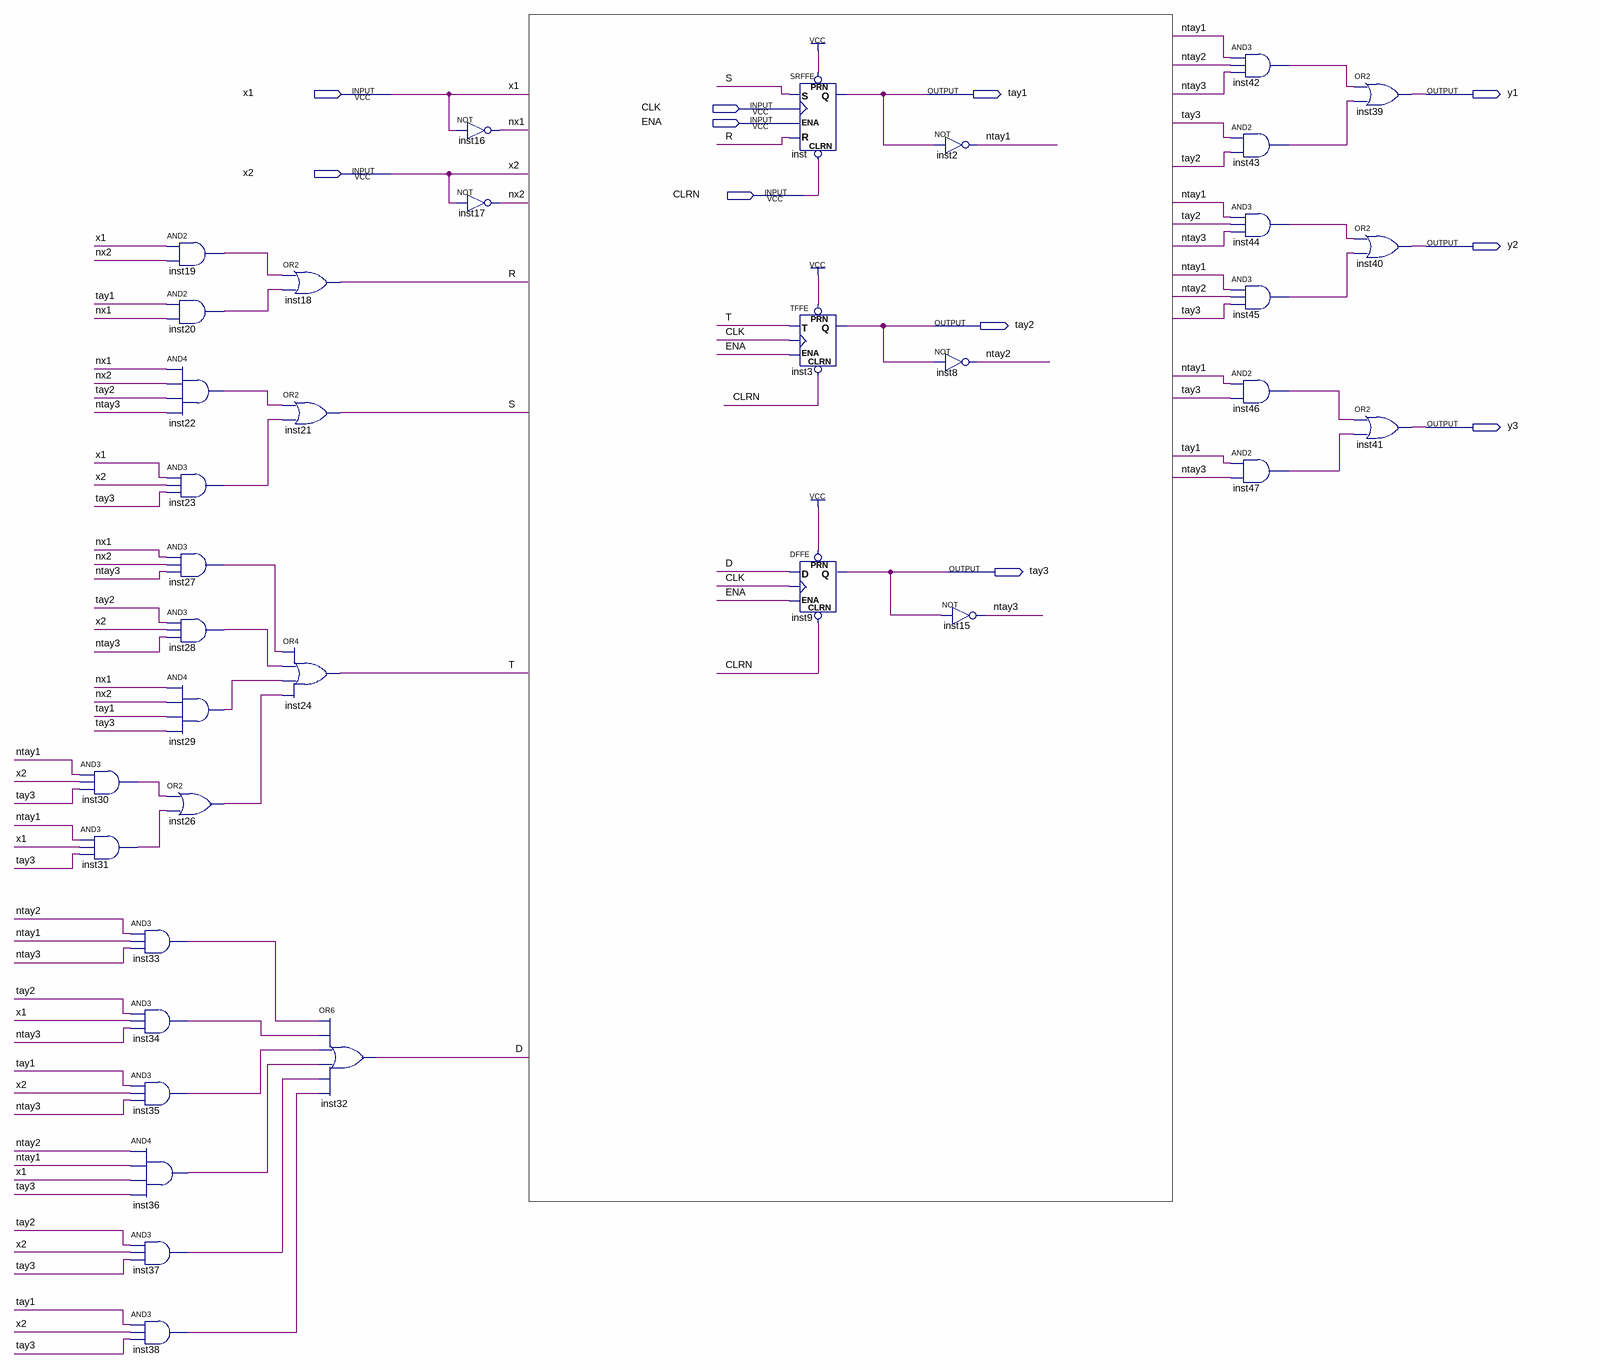
[diagram p0: schematic sheet]
// Quartus schematic a_moore.bdf as structural Verilog: 37 symbols, 11 pins
module a_moore (
  input  x1,
  input  CLK,
  input  ENA,
  input  x2,
  input  CLRN,
  output tay1,
  output y1,
  output y2,
  output tay2,
  output y3,
  output tay3
);

  wire D, inst19_out, inst20_out, inst22_out, inst23_out, inst26_out, inst27_out, inst28_out, inst29_out,
       inst30_out, inst31_out, inst33_out, inst34_out, inst35_out, inst36_out, inst37_out, inst38_out,
       inst42_out, inst43_out, inst44_out, inst45_out, inst46_out, inst47_out, ntay1, ntay2, ntay3, nx1, nx2,
       R, S, T;

  and inst30 (inst30_out, ntay1, x2, tay3);
  and inst31 (inst31_out, ntay1, x1, tay3);
  and inst33 (inst33_out, ntay2, ntay1, ntay3);
  and inst34 (inst34_out, tay2, x1, ntay3);
  and inst35 (inst35_out, tay1, x2, ntay3);
  and inst36 (inst36_out, ntay2, ntay1, x1, tay3);
  and inst37 (inst37_out, tay2, x2, tay3);
  and inst38 (inst38_out, tay1, x2, tay3);
  and inst19 (inst19_out, x1, nx2);
  and inst20 (inst20_out, tay1, nx1);
  and inst22 (inst22_out, nx1, nx2, tay2, ntay3);
  and inst23 (inst23_out, x1, x2, tay3);
  and inst27 (inst27_out, nx1, nx2, ntay3);
  and inst28 (inst28_out, tay2, x2, ntay3);
  and inst29 (inst29_out, nx1, nx2, tay1, tay3);
  or inst26 (inst26_out, inst30_out, inst31_out);
  or inst18 (R, inst19_out, inst20_out);
  or inst21 (S, inst22_out, inst23_out);
  or inst24 (T, inst27_out, inst28_out, inst29_out, inst26_out);
  or inst32 (D, inst33_out, inst34_out, inst35_out, inst36_out, inst37_out, inst38_out);
  not inst16 (nx1, x1);
  not inst17 (nx2, x2);
  SRFFE inst (.PRN(1'b1), .S(S), .CLK(CLK), .CLRN(CLRN), .R(R), .ENA(ENA), .Q(tay1));
  TFFE inst3 (.CLRN(CLRN), .T(T), .CLK(CLK), .ENA(ENA), .PRN(1'b1), .Q(tay2));
  DFFE inst9 (.PRN(1'b1), .CLRN(CLRN), .D(D), .CLK(CLK), .ENA(ENA), .Q(tay3));
  not inst2 (ntay1, tay1);
  not inst8 (ntay2, tay2);
  not inst15 (ntay3, tay3);
  and inst42 (inst42_out, ntay1, ntay2, ntay3);
  and inst43 (inst43_out, tay3, tay2);
  and inst44 (inst44_out, ntay1, tay2, ntay3);
  and inst45 (inst45_out, ntay1, ntay2, tay3);
  and inst46 (inst46_out, ntay1, tay3);
  and inst47 (inst47_out, tay1, ntay3);
  or inst39 (y1, inst42_out, inst43_out);
  or inst40 (y2, inst44_out, inst45_out);
  or inst41 (y3, inst46_out, inst47_out);
endmodule
